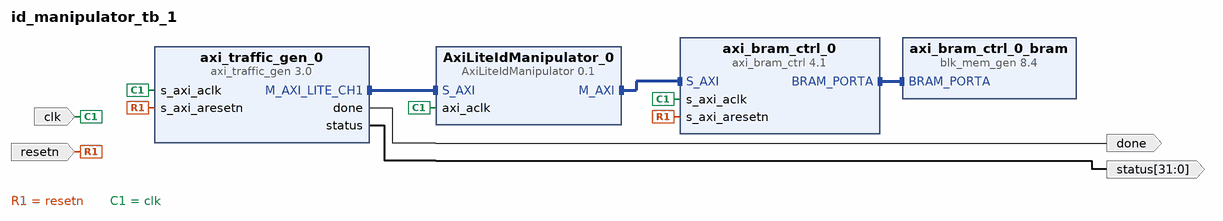
[diagram p0: block diagram of the top level]
# Vivado block design id_manipulator_tb_1, xc7z045ffg900-2, Vivado 2020.2
create_bd_design id_manipulator_tb_1

create_bd_port -dir I clk
create_bd_port -dir I resetn
create_bd_port -dir O done
create_bd_port -dir O -from 31 -to 0 status

create_bd_cell -type ip -vlnv xilinx.com:ip:axi_traffic_gen:3.0 axi_traffic_gen_0
set_property -dict [list \
  CONFIG.C_ATG_MODE AXI4-Lite \
  CONFIG.C_ATG_SYSINIT_MODES System_Test \
  CONFIG.C_ATG_SYSTEM_CMD_MAX_RETRY 2147483647 \
  CONFIG.C_ATG_SYSTEM_INIT_ADDR_MIF ../../axi_traffic_gen_address.coe \
  CONFIG.C_ATG_SYSTEM_INIT_CTRL_MIF ../../axi_traffic_gen_control.coe \
  CONFIG.C_ATG_SYSTEM_INIT_DATA_MIF ../../axi_traffic_gen_data.coe \
  CONFIG.C_ATG_SYSTEM_INIT_MASK_MIF ../../axi_traffic_gen_mask.coe \
] [get_bd_cells axi_traffic_gen_0]
create_bd_cell -type ip -vlnv xilinx.com:ip:axi_bram_ctrl:4.1 axi_bram_ctrl_0
set_property -dict {CONFIG.SINGLE_PORT_BRAM 1} [get_bd_cells axi_bram_ctrl_0]
create_bd_cell -type ip -vlnv xilinx.com:ip:blk_mem_gen:8.4 axi_bram_ctrl_0_bram
create_bd_cell -type ip -vlnv xilinx.com:user:AxiLiteIdManipulator:0.1 AxiLiteIdManipulator_0

# ---- connections ----

connect_bd_intf_net [get_bd_intf_pins axi_bram_ctrl_0/S_AXI] [get_bd_intf_pins AxiLiteIdManipulator_0/M_AXI]
connect_bd_intf_net [get_bd_intf_pins axi_bram_ctrl_0_bram/BRAM_PORTA] [get_bd_intf_pins axi_bram_ctrl_0/BRAM_PORTA]
connect_bd_intf_net [get_bd_intf_pins axi_traffic_gen_0/M_AXI_LITE_CH1] [get_bd_intf_pins AxiLiteIdManipulator_0/S_AXI]
connect_bd_net [get_bd_ports resetn] [get_bd_pins axi_traffic_gen_0/s_axi_aresetn] [get_bd_pins axi_bram_ctrl_0/s_axi_aresetn]
connect_bd_net [get_bd_ports clk] \
  [get_bd_pins axi_traffic_gen_0/s_axi_aclk] [get_bd_pins axi_bram_ctrl_0/s_axi_aclk] \
  [get_bd_pins AxiLiteIdManipulator_0/axi_aclk]
connect_bd_net [get_bd_pins axi_traffic_gen_0/done] [get_bd_ports done]
connect_bd_net [get_bd_pins axi_traffic_gen_0/status] [get_bd_ports status]

# ---- address map ----
assign_bd_address -offset 0x00000000 -range 64K -target_address_space [get_bd_addr_spaces axi_traffic_gen_0/Reg1] [get_bd_addr_segs AxiLiteIdManipulator_0/S_AXI/S_AXI_reg]
assign_bd_address -offset 0x00000000 -range 8K -target_address_space [get_bd_addr_spaces AxiLiteIdManipulator_0/M_AXI] [get_bd_addr_segs axi_bram_ctrl_0/S_AXI/Mem0]

validate_bd_design
save_bd_design
